# EAGLE schematic TabStopsDriver (EAGLE 9.6.2)
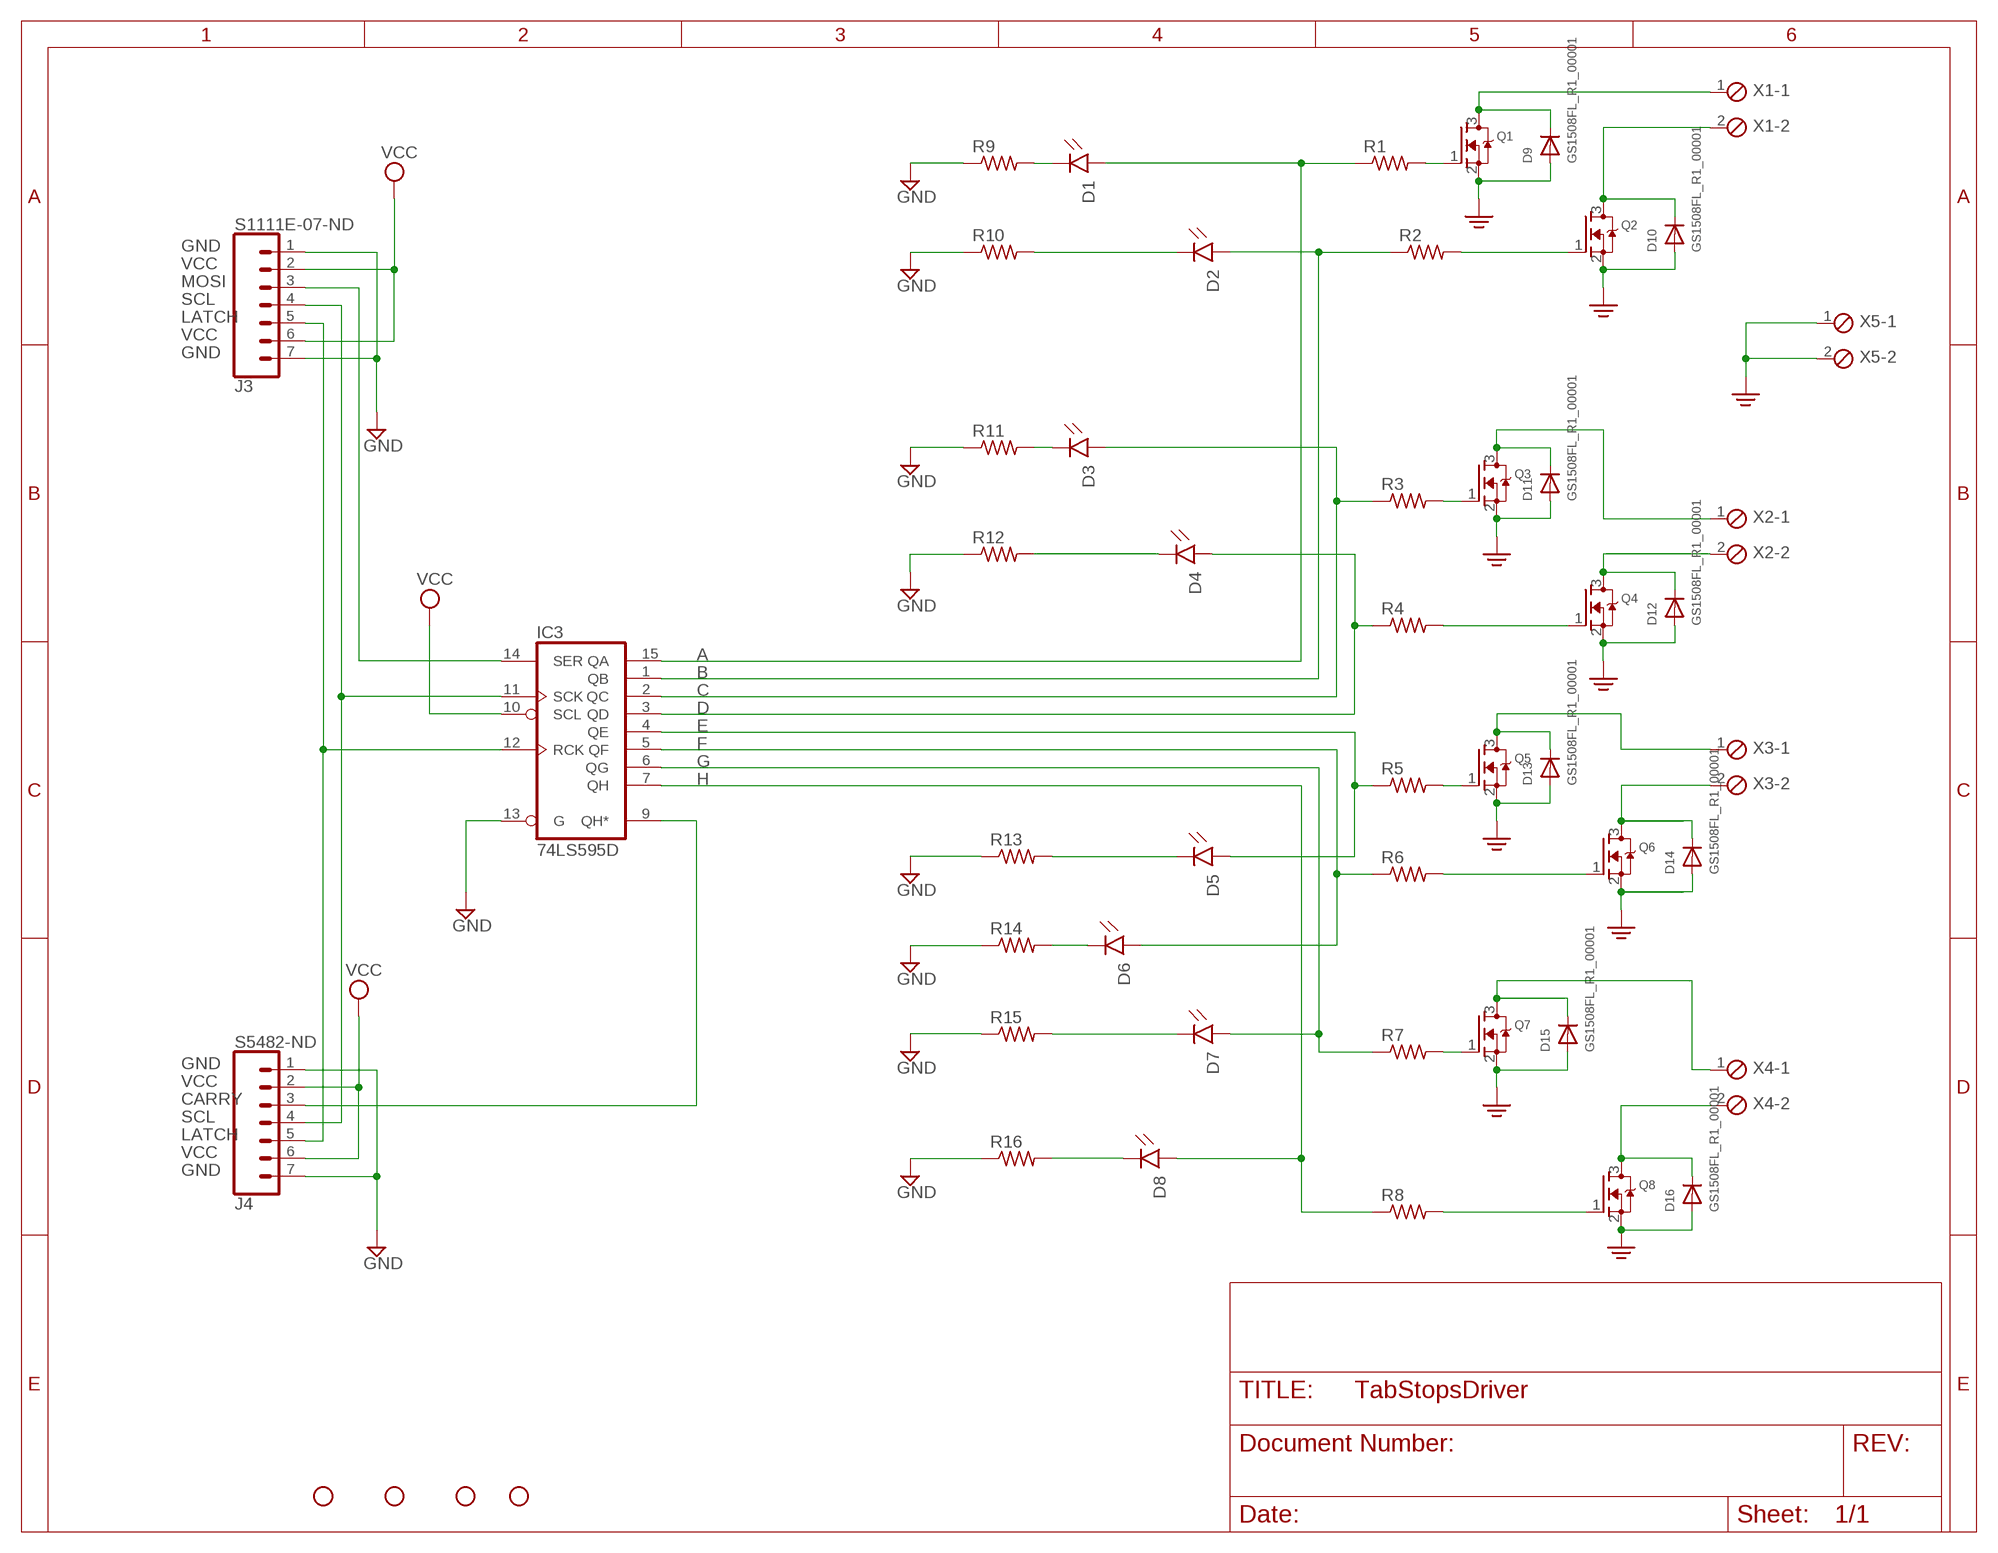
[diagram p0: schematic, sheet 1]

## Parts
D1  B1911NB--20C005314U1930  CHIP-ROUND-R_0603-1MM  [LEDC1608X95N_RND-R]
D2  B1911NB--20C005314U1930  CHIP-ROUND-R_0603-1MM  [LEDC1608X95N_RND-R]
D3  B1911NB--20C005314U1930  CHIP-ROUND-R_0603-1MM  [LEDC1608X95N_RND-R]
D4  B1911NB--20C005314U1930  CHIP-ROUND-R_0603-1MM  [LEDC1608X95N_RND-R]
D5  B1911NB--20C005314U1930  CHIP-ROUND-R_0603-1MM  [LEDC1608X95N_RND-R]
D6  B1911NB--20C005314U1930  CHIP-ROUND-R_0603-1MM  [LEDC1608X95N_RND-R]
D7  B1911NB--20C005314U1930  CHIP-ROUND-R_0603-1MM  [LEDC1608X95N_RND-R]
D8  B1911NB--20C005314U1930  CHIP-ROUND-R_0603-1MM  [LEDC1608X95N_RND-R]
D9  GS1508FL_R1_00001  DIODE_SOD-123FL  [SOD-123FL]
D10  GS1508FL_R1_00001  DIODE_SOD-123FL  [SOD-123FL]
D11  GS1508FL_R1_00001  DIODE_SOD-123FL  [SOD-123FL]
D12  GS1508FL_R1_00001  DIODE_SOD-123FL  [SOD-123FL]
D13  GS1508FL_R1_00001  DIODE_SOD-123FL  [SOD-123FL]
D14  GS1508FL_R1_00001  DIODE_SOD-123FL  [SOD-123FL]
D15  GS1508FL_R1_00001  DIODE_SOD-123FL  [SOD-123FL]
D16  GS1508FL_R1_00001  DIODE_SOD-123FL  [SOD-123FL]
H1  STAND-OFF  [STAND-OFF]
H2  STAND-OFF  [STAND-OFF]
H3  STAND-OFF  [STAND-OFF]
H4  STAND-OFF  [STAND-OFF]
IC3  74LS595D  [SO16]
J3  S1111E-07-ND  CONN_07LONGPADS  [1X07_LONGPADS]
J4  S5482-ND  CONN_07LONGPADS  [1X07_LONGPADS]
Q1  3757-PJA3416A_R1_00001CT-ND  MOSFET-NREFLOW  [SOT23]
Q2  3757-PJA3416A_R1_00001CT-ND  MOSFET-NREFLOW  [SOT23]
Q3  3757-PJA3416A_R1_00001CT-ND  MOSFET-NREFLOW  [SOT23]
Q4  3757-PJA3416A_R1_00001CT-ND  MOSFET-NREFLOW  [SOT23]
Q5  3757-PJA3416A_R1_00001CT-ND  MOSFET-NREFLOW  [SOT23]
Q6  3757-PJA3416A_R1_00001CT-ND  MOSFET-NREFLOW  [SOT23]
Q7  3757-PJA3416A_R1_00001CT-ND  MOSFET-NREFLOW  [SOT23]
Q8  3757-PJA3416A_R1_00001CT-ND  MOSFET-NREFLOW  [SOT23]
R1  RMCF0805FT100RCT-ND  R-US_R0805  [R0805]
R2  RMCF0805FT100RCT-ND  R-US_R0805  [R0805]
R3  RMCF0805FT100RCT-ND  R-US_R0805  [R0805]
R4  RMCF0805FT100RCT-ND  R-US_R0805  [R0805]
R5  RMCF0805FT100RCT-ND  R-US_R0805  [R0805]
R6  RMCF0805FT100RCT-ND  R-US_R0805  [R0805]
R7  RMCF0805FT100RCT-ND  R-US_R0805  [R0805]
R8  RMCF0805FT100RCT-ND  R-US_R0805  [R0805]
R9  RMCF0805FT1K50CT-ND  R-US_R0805  [R0805]
R10  RMCF0805FT1K50CT-ND  R-US_R0805  [R0805]
R11  RMCF0805FT1K50CT-ND  R-US_R0805  [R0805]
R12  RMCF0805FT1K50CT-ND  R-US_R0805  [R0805]
R13  RMCF0805FT1K50CT-ND  R-US_R0805  [R0805]
R14  RMCF0805FT1K50CT-ND  R-US_R0805  [R0805]
R15  RMCF0805FT1K50CT-ND  R-US_R0805  [R0805]
R16  RMCF0805FT1K50CT-ND  R-US_R0805  [R0805]
X1  277-6156-ND  MPT2  [2POL254]
X2  277-6156-ND  MPT2  [2POL254]
X3  277-6156-ND  MPT2  [2POL254]
X4  277-6156-ND  MPT2  [2POL254]
X5  277-6156-ND  MPT2  [2POL254]

## Nets
A: D1.A IC3.15(QA) R1.1
B: D2.A IC3.1(QB) R2.1
C: D3.A IC3.2(QC) R3.1
CARRY: IC3.9(QH*) J4.3
D: D4.A IC3.3(QD) R4.1
E: D5.A IC3.4(QE) R5.1
EGND [power]: D9.A D10.A D11.A D12.A D13.A D14.A D15.A D16.A Q1.2(S) Q2.2(S) Q3.2(S) Q4.2(S) Q5.2(S) Q6.2(S) Q7.2(S) Q8.2(S) X5.1 X5.2
F: D6.A IC3.5(QF) R6.1
G: D7.A IC3.6(QG) R7.1
GND: IC3.13(G) J3.1 J3.7 J4.1 J4.7 R9.1 R10.1 R11.1 R12.1 R13.1 R14.1 R15.1 R16.1
H: D8.A IC3.7(QH) R8.1
LATCH: IC3.12(RCK) J3.5 J4.5
MOSI: IC3.14(SER) J3.3
N$2: Q3.1(G) R3.2
N$6: Q2.1(G) R2.2
N$7: Q1.1(G) R1.2
N$8: Q4.1(G) R4.2
N$9: Q6.1(G) R6.2
N$10: Q5.1(G) R5.2
N$11: Q7.1(G) R7.2
N$12: Q8.1(G) R8.2
N$21 [power]: D9.C Q1.3(D) X1.1
N$22 [power]: D10.C Q2.3(D) X1.2
N$23 [power]: D11.C Q3.3(D) X2.1
N$24 [power]: D12.C Q4.3(D) X2.2
N$25 [power]: D13.C Q5.3(D) X3.1
N$26 [power]: D14.C Q6.3(D) X3.2
N$27 [power]: D15.C Q7.3(D) X4.1
N$28 [power]: D16.C Q8.3(D) X4.2
N$29: D1.C R9.2
N$30: D2.C R10.2
N$31: D3.C R11.2
N$32: D4.C R12.2
N$33: D5.C R13.2
N$34: D6.C R14.2
N$35: D7.C R15.2
N$36: D8.C R16.2
SCL: IC3.11(SCK) J3.4 J4.4
VCC: IC3.10(SCL) J3.2 J3.6 J4.2 J4.6

## Power pins joined to a net without a drawn wire
GND: IC3.8(GND)
VCC: IC3.16(VCC)

## Library data of the parts
D1-D8 = LED:CHIP-ROUND-R: LED - Generic; CATEGORY: LED; COLOR: RED; DESCRIPTION: CHIP LED ROUND; SUB-CATEGORY: CHIP; TYPE: ROUND_TOP; VALUE: LED_RED
D9-D16 = adafruit:DIODE: Diode SMADIODE - SMA Surface Mount Package 20V 1A Schottky Diode Digikey: 641-1014-6-ND DO-1N4148 - Through Hole Small Current Diode SOD-123 20V 1 A (.5mV Vf) Schottky Diode - Digikey: MBRX120TPMSCT-ND SOD-323 10V 570mA (.38mV Vf, 3ns) Schottky Diode - Digikey: ZLLS410CT-ND SOD-523 30V 30mA Schottky Diode (RB751S-40TE61) - Digikey: RB751S-40TE61CT-ND SOT23-R/W - SOT23 Package (R = Solder Paste/Reflow Ovens, W = Hand-Soldering) BAT54Film 40V 300mA - Digikey: 497-7162-1-ND
H1-H4 = SparkFun-Hardware:STAND-OFF: Stand Off Drill holes for mechanically mounting via screws, standoffs, etc. Note: Use the keepout ring to avoid running the screw head into surrounding components. Variant Overviews STAND-OFF - Mechanical footprint for a #4 phillips button head screw. STAND-OFF-TIGHT - Mechanical footprint for a #4 phillips button head screw, Example SparkFun Products Screw - Phillips Head (1/4", 4-40, 10 pack) <https://www.sparkfun.com/products/10453> (PRT-10453) Screw - Phillips Head (1/2", 4-40, 10 pack) <https://www.sparkfun.com/products/10452> (PRT-10452) Screw - Phillips Head (3/4", 4-40, 10 pack) <https://www.sparkfun.com/products/10451> (PRT-10451) Screw - Phillips Head (1", 4-40, 10 pack) <https://www.sparkfun.com/products/10450> (PRT-10450)
IC3 = 74xx-us:74*595: 8-bit SHIFT REGISTER, output latch
J3 J4 = SparkFun-Connectors:CONN_07: Multi connection point. Often used as Generic Header-pin footprint for 0.1 inch spaced/style header connections On any of the 0.1 inch spaced packages, you can populate with these: Break Away Headers - Straight <https://www.sparkfun.com/products/116> (PRT-00116) Break Away Male Headers - Right Angle <https://www.sparkfun.com/products/553> (PRT-00553) Female Headers <https://www.sparkfun.com/products/115> (PRT-00115) Break Away Headers - Machine Pin <https://www.sparkfun.com/products/117> (PRT-00117) Break Away Female Headers - Swiss Machine Pin <https://www.sparkfun.com/products/743> (PRT-00743) For SCREWTERMINALS and SPRING TERMINALS visit here: Screw Terimnals on SparkFun.com <https://www.sparkfun.com/search/results?term=Screw+Terminals> (5mm/3.5mm/2.54mm spacing) This device is also useful as a general connection point to wire up your design to another part of your project. Our various solder wires solder well into these plated through hole pads. Hook-Up Wire - Assortment (Stranded, 22 AWG) <https://www.sparkfun.com/products/11375> (PRT-11375) Hook-Up Wire - Assortment (Solid Core, 22 AWG) <https://www.sparkfun.com/products/11367> (PRT-11367) View the entire wire category on our website here <https://www.sparkfun.com/categories/141> Special notes: Molex polarized connector foot print use with SKU : PRT-08231 with associated crimp pins and housings. 1MM SMD Version SKU: PRT-10208 NOTES ON THE VARIANTS LOCK and LOCK_LONGPADS... This footprint was designed to help hold the alignment of a through-hole component (i.e. 6-pin header) while soldering it into place. You may notice that each hole has been shifted either up or down by 0.005 of an inch from it's more standard position (which is a perfectly straight line). This slight alteration caused the pins (the squares in the middle) to touch the edges of the holes. Because they are alternating, it causes a "brace" to hold the component in place. 0.005 has proven to be the perfect amount of "off-center" position when using our standard breakaway headers. Although looks a little odd when you look at the bare footprint, once you have a header in there, the alteration is very hard to notice. Also,if you push a header all the way into place, it is covered up entirely on the bottom side.
Q1-Q8 = adafruit:MOSFET-N: N-Channel Mosfet 2N7002E - 60V 260mA SOT23 [Digikey: 2N7002ET1GOSTR-ND] - REEL BSH103 - 30V 850mA SOT23 [Digikey: 568-5013-1-ND]
R1-R16 = rcl:R-US_: RESISTOR, American symbol; SPICEPREFIX: R
X1-X5 = con-phoenix-254:MPT2: PHOENIX CONNECTOR; OC_FARNELL: unknown; OC_NEWARK: unknown

## Net classes
0 default: width 0.254 mm
1 power: width 0.762 mm